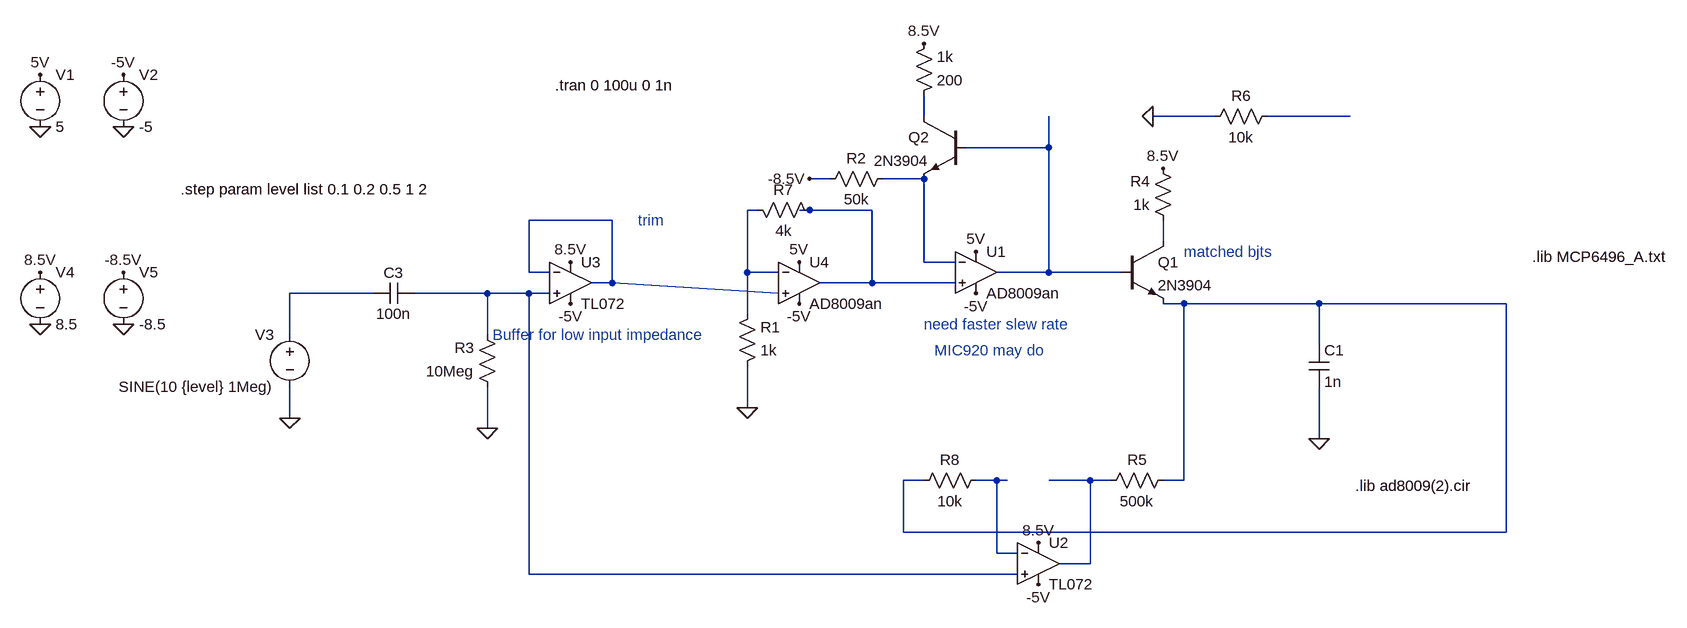
[diagram p0: schematic test_the_tee.asc]
test_the_tee.asc, the LTspice schematic file:
Version 4
SHEET 1 1516 836
WIRE 352 32 352 0
WIRE 800 32 704 32
WIRE 1008 32 880 32
WIRE 544 80 544 32
WIRE 544 80 416 80
WIRE 208 128 176 128
WIRE 352 128 288 128
WIRE 96 176 80 176
WIRE 176 176 160 176
WIRE 272 176 176 176
WIRE -128 192 -256 192
WIRE 720 224 720 192
WIRE 352 256 352 128
WIRE 400 256 352 256
WIRE -256 272 -256 192
WIRE -224 272 -256 272
WIRE 80 272 80 176
WIRE 128 272 80 272
WIRE 544 272 544 80
WIRE 544 272 464 272
WIRE 656 272 544 272
WIRE -128 288 -128 192
WIRE -128 288 -160 288
WIRE 272 288 272 176
WIRE 272 288 192 288
WIRE 400 288 272 288
WIRE -496 304 -624 304
WIRE -320 304 -432 304
WIRE -256 304 -320 304
WIRE -224 304 -256 304
WIRE 128 304 -128 288
WIRE 752 320 720 320
WIRE 960 320 752 320
WIRE 1248 320 960 320
WIRE 80 336 80 272
WIRE -624 368 -624 304
WIRE -320 368 -320 304
WIRE 960 384 960 320
WIRE 80 480 80 416
WIRE -624 496 -624 448
WIRE -320 512 -320 448
WIRE 960 528 960 448
WIRE 352 592 320 592
WIRE 464 592 432 592
WIRE 480 592 464 592
WIRE 608 592 544 592
WIRE 640 592 608 592
WIRE 752 592 752 320
WIRE 752 592 720 592
WIRE 320 672 320 592
WIRE 1248 672 1248 320
WIRE 1248 672 320 672
WIRE 464 704 464 592
WIRE 496 704 464 704
WIRE 608 720 608 592
WIRE 608 720 560 720
WIRE -256 736 -256 304
WIRE 496 736 -256 736
FLAG -1008 48 0
FLAG 432 240 5V
FLAG -1008 -32 5V
FLAG -880 48 0
FLAG -880 -32 -5V
FLAG 432 304 -5V
FLAG 960 528 0
FLAG -624 496 0
FLAG 528 688 8.5V
FLAG 528 752 -5V
FLAG -1008 352 0
FLAG -1008 272 8.5V
FLAG -880 352 0
FLAG -880 272 -8.5V
FLAG 720 112 8.5V
FLAG 352 -80 8.5V
FLAG 176 128 -8.5V
FLAG 704 32 0
FLAG -320 512 0
FLAG -192 256 8.5V
FLAG -192 320 -5V
FLAG 160 256 5V
FLAG 160 320 -5V
FLAG 80 480 0
SYMBOL voltage -1008 -48 R0
WINDOW 123 0 0 Left 0
WINDOW 39 0 0 Left 0
SYMATTR InstName V1
SYMATTR Value 5
SYMBOL voltage -880 -48 R0
WINDOW 123 0 0 Left 0
WINDOW 39 0 0 Left 0
SYMATTR InstName V2
SYMATTR Value -5
SYMBOL cap 944 384 R0
SYMATTR InstName C1
SYMATTR Value 1n
SYMBOL voltage -624 352 M0
WINDOW 123 0 0 Left 0
WINDOW 39 0 0 Left 0
SYMATTR InstName V3
SYMATTR Value SINE(10 {level} 1Meg)
SYMBOL npn 656 224 R0
SYMATTR InstName Q1
SYMATTR Value 2N3904
SYMBOL voltage -1008 256 R0
WINDOW 123 0 0 Left 0
WINDOW 39 0 0 Left 0
SYMATTR InstName V4
SYMATTR Value 8.5
SYMBOL voltage -880 256 R0
WINDOW 123 0 0 Left 0
WINDOW 39 0 0 Left 0
SYMATTR InstName V5
SYMATTR Value -8.5
SYMBOL res 736 208 R180
WINDOW 0 36 76 Left 2
WINDOW 3 36 40 Left 2
SYMATTR InstName R4
SYMATTR Value 1k
SYMBOL npn 416 32 M0
SYMATTR InstName Q2
SYMATTR Value 2N3904
SYMBOL res 336 16 M180
WINDOW 0 36 76 Left 2
WINDOW 3 36 40 Left 2
SYMATTR InstName 1k
SYMATTR Value 200
SYMBOL res 304 112 R90
WINDOW 0 0 56 VBottom 2
WINDOW 3 32 56 VTop 2
SYMATTR InstName R2
SYMATTR Value 50k
SYMBOL res 896 16 R90
WINDOW 0 0 56 VBottom 2
WINDOW 3 32 56 VTop 2
SYMATTR InstName R6
SYMATTR Value 10k
SYMBOL ZZZ\\OpAmp\\TL072 432 272 R0
SYMATTR InstName U1
SYMATTR Value AD8009an
SYMBOL ZZZ\\OpAmp\\TL072 528 720 R0
SYMATTR InstName U2
SYMBOL cap -432 288 R90
WINDOW 0 0 32 VBottom 2
WINDOW 3 32 32 VTop 2
SYMATTR InstName C3
SYMATTR Value 100n
SYMBOL res -304 464 R180
WINDOW 0 36 76 Left 2
WINDOW 3 36 40 Left 2
SYMATTR InstName R3
SYMATTR Value 10Meg
SYMBOL ZZZ\\OpAmp\\TL072 -192 288 R0
SYMATTR InstName U3
SYMBOL res 736 576 R90
WINDOW 0 0 56 VBottom 2
WINDOW 3 32 56 VTop 2
SYMATTR InstName R5
SYMATTR Value 500k
SYMBOL res 448 576 R90
WINDOW 0 0 56 VBottom 2
WINDOW 3 32 56 VTop 2
SYMATTR InstName R8
SYMATTR Value 10k
SYMBOL ZZZ\\OpAmp\\TL072 160 288 R0
SYMATTR InstName U4
SYMATTR Value AD8009an
SYMBOL res 64 432 M180
WINDOW 0 36 76 Left 2
WINDOW 3 36 40 Left 2
SYMATTR InstName R1
SYMATTR Value 1k
SYMBOL res 80 160 M90
WINDOW 0 0 56 VBottom 2
WINDOW 3 32 56 VTop 2
SYMATTR InstName R7
SYMATTR Value 4k
TEXT -216 -16 Left 2 !.tran 0 100u 0 1n
TEXT 1016 600 Left 2 !.lib ad8009(2).cir
TEXT 1288 248 Left 2 !.lib MCP6496_A.txt
TEXT 352 352 Left 2 ;need faster slew rate
TEXT -88 192 Left 2 ;trim
TEXT -312 368 Left 2 ;Buffer for low input impedance
TEXT 368 392 Left 2 ;MIC920 may do
TEXT 752 240 Left 2 ;matched bjts
TEXT -792 144 Left 2 !.step param level list 0.1 0.2 0.5 1 2

The netlist it stands for:
* test_the_tee.asc
V1 5V 0 5
V2 -5V 0 -5
C1 N011 0 1n
V3 N009 0 SINE(10 {level} 1Meg)
Q1 N008 N003 N011 0 2N3904
V4 8.5V 0 8.5
V5 -8.5V 0 -8.5
R4 N008 8.5V 1k
Q2 N001 N003 N004 0 2N3904
R§1k N001 8.5V 200
R2 N004 -8.5V 50k
R6 N002 0 10k
* U1: AD8009an (symbol ZZZ\OpAmp\TL072 not available, pins judged from their places): In+=N006 In-=N004 V+=5V V-=-5V OUT=N003
* U2: TL072 (symbol ZZZ\OpAmp\TL072 not available, pins judged from their places): In+=N010 In-=N012 V+=8.5V V-=-5V OUT=N013
C3 N010 N009 100n
R3 0 N010 10Meg
* U3: TL072 (symbol ZZZ\OpAmp\TL072 not available, pins judged from their places): In+=N010 In-=N007 V+=8.5V V-=-5V OUT=N007
R5 N011 N013 500k
R8 N012 N011 10k
* U4: AD8009an (symbol ZZZ\OpAmp\TL072 not available, pins judged from their places): In+=N007 In-=N005 V+=5V V-=-5V OUT=N006
R1 0 N005 1k
R7 N005 N006 4k
.model NPN NPN
.model PNP PNP
.lib standard.bjt
.tran 0 100u 0 1n
.lib ad8009(2).cir
.lib MCP6496_A.txt
* need faster slew rate
* trim
* Buffer for low input impedance
* MIC920 may do
* matched bjts
.step param level list 0.1 0.2 0.5 1 2
.backanno
.end